# EAGLE schematic phase and amplifier (EAGLE 9.1.2)
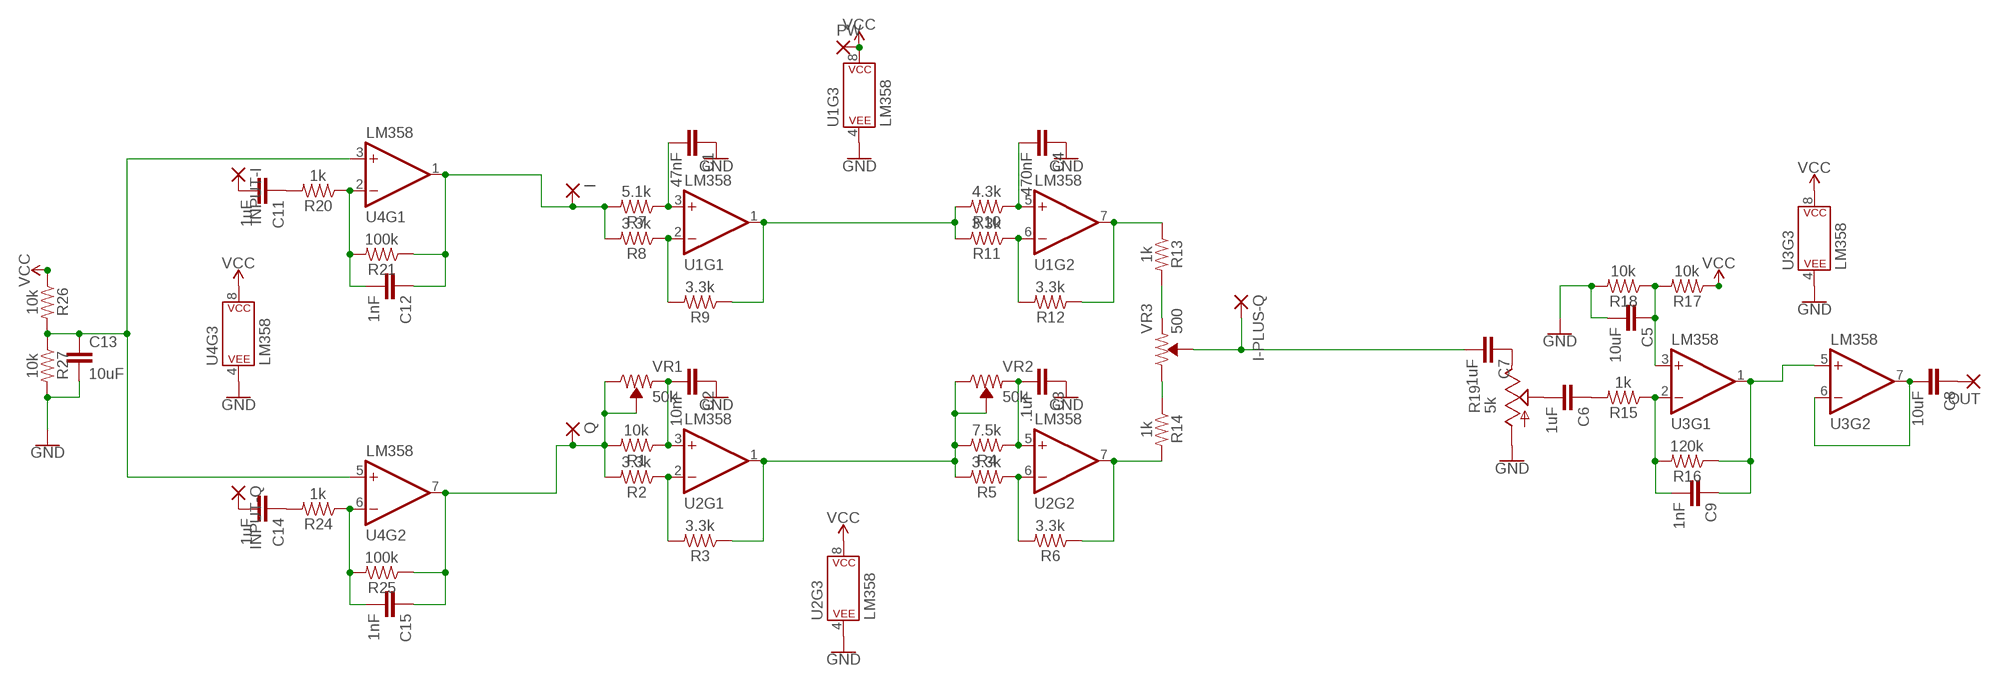
[diagram p0: schematic, sheet 1]

## Parts
C1  47nF  C5/3.5  [C5B3.5]
C2  10nF  C5/3.5  [C5B3.5]
C3  .1uF  C5/3.5  [C5B3.5]
C4  470nF  C5/3.5  [C5B3.5]
C5  10uF  C5/3.5  [C5B3.5]
C6  1uF  C5/3.5  [C5B3.5]
C7  1uF  C5/3.5  [C5B3.5]
C8  10uF  C5/3.5  [C5B3.5]
C9  1nF  C5/3.5  [C5B3.5]
C11  1uF  C5/3.5  [C5B3.5]
C12  1nF  C5/3.5  [C5B3.5]
C13  10uF  C5/3.5  [C5B3.5]
C14  1uF  C5/3.5  [C5B3.5]
C15  1nF  C5/3.5  [C5B3.5]
I  2,54/1,1  [2,54/1,1]
I-PLUS-Q  2,54/1,1  [2,54/1,1]
INPUT-I  2,54/1,1  [2,54/1,1]
INPUT-Q  2,54/1,1  [2,54/1,1]
OUT  2,54/1,1  [2,54/1,1]
PW  2,54/1,1  [2,54/1,1]
Q  2,54/1,1  [2,54/1,1]
R1  10k  1KOHM-HORIZ-1/4W-1%  [AXIAL-0.3]
R2  3.3k  1KOHM-HORIZ-1/4W-1%  [AXIAL-0.3]
R3  3.3k  1KOHM-HORIZ-1/4W-1%  [AXIAL-0.3]
R4  7.5k  1KOHM-HORIZ-1/4W-1%  [AXIAL-0.3]
R5  3.3k  1KOHM-HORIZ-1/4W-1%  [AXIAL-0.3]
R6  3.3k  1KOHM-HORIZ-1/4W-1%  [AXIAL-0.3]
R7  5.1k  1KOHM-HORIZ-1/4W-1%  [AXIAL-0.3]
R8  3.3k  1KOHM-HORIZ-1/4W-1%  [AXIAL-0.3]
R9  3.3k  1KOHM-HORIZ-1/4W-1%  [AXIAL-0.3]
R10  4.3k  1KOHM-HORIZ-1/4W-1%  [AXIAL-0.3]
R11  3.3k  1KOHM-HORIZ-1/4W-1%  [AXIAL-0.3]
R12  3.3k  1KOHM-HORIZ-1/4W-1%  [AXIAL-0.3]
R13  1k  1KOHM-HORIZ-1/4W-1%  [AXIAL-0.3]
R14  1k  1KOHM-HORIZ-1/4W-1%  [AXIAL-0.3]
R15  1k  1KOHM-HORIZ-1/4W-1%  [AXIAL-0.3]
R16  120k  1KOHM-HORIZ-1/4W-1%  [AXIAL-0.3]
R17  10k  1KOHM-HORIZ-1/4W-1%  [AXIAL-0.3]
R18  10k  1KOHM-HORIZ-1/4W-1%  [AXIAL-0.3]
R19  5k  TRIM_US-B25V  [B25V]
R20  1k  1KOHM-HORIZ-1/4W-1%  [AXIAL-0.3]
R21  100k  1KOHM-HORIZ-1/4W-1%  [AXIAL-0.3]
R24  1k  1KOHM-HORIZ-1/4W-1%  [AXIAL-0.3]
R25  100k  1KOHM-HORIZ-1/4W-1%  [AXIAL-0.3]
R26  10k  1KOHM-HORIZ-1/4W-1%  [AXIAL-0.3]
R27  10k  1KOHM-HORIZ-1/4W-1%  [AXIAL-0.3]
U1  LM358  [DIP08]
U2  LM358  [DIP08]
U3  LM358  [DIP08]
U4  LM358  [DIP08]
VR1  50k  TRIMPOT-PTH-10MM-KNOB-1/2W-10%  [TRIMPOT-PTH-3386U]
VR2  50k  TRIMPOT-PTH-10MM-KNOB-1/2W-10%  [TRIMPOT-PTH-3386U]
VR3  500  TRIMPOT-PTH-10MM-KNOB-1/2W-10%  [TRIMPOT-PTH-3386U]

## Nets
GND: C1.1 C2.1 C3.1 C4.1 C5.2 C13.2 R18.P$2 R19.A R27.P$2 U1.4(P$V-) U2.4(P$V-) U3.4(P$V-) U4.4(P$V-)
N$1: C2.2 R1.P$1 U2.3(+IN) VR1.1(CCW)
N$2: R2.P$1 R3.P$2 U2.2(-IN)
N$3: R3.P$1 R4.P$2 R5.P$2 U2.1(OUT) VR2.2(WIPER) VR2.3(CW)
N$4: C13.1 R26.P$2 R27.P$1 U4.3(+IN) U4.5(+IN)
N$5: C3.2 R4.P$1 U2.5(+IN) VR2.1(CCW)
N$6: R5.P$1 R6.P$2 U2.6(-IN)
N$7: R8.P$1 R9.P$2 U1.2(-IN)
N$8: R6.P$1 R14.P$2 U2.7(OUT)
N$9: C1.2 R7.P$1 U1.3(+IN)
N$10: C14.2 INPUT-Q.1(P)
N$11: C4.2 R10.P$1 U1.5(+IN)
N$12: R9.P$1 R10.P$2 R11.P$2 U1.1(OUT)
N$13: R11.P$1 R12.P$2 U1.6(-IN)
N$14: R13.P$2 VR3.1(CCW)
N$15: R12.P$1 R13.P$1 U1.7(OUT)
N$16: R14.P$1 VR3.3(CW)
N$17: C7.2 I-PLUS-Q.1(P) VR3.2(WIPER)
N$18: C9.1 R16.P$1 U3.1(OUT) U3.5(+IN)
N$19: C9.2 R15.P$1 R16.P$2 U3.2(-IN)
N$20: C5.1 R17.P$2 R18.P$1 U3.3(+IN)
N$21: C6.1 R15.P$2
N$22: C6.2 R19.S
N$23: C7.1 R19.E
N$24: C12.1 I.1(P) R7.P$2 R8.P$2 R21.P$1 U4.1(OUT)
N$25: C8.2 U3.6(-IN) U3.7(OUT)
N$26: C8.1 OUT.1(P)
N$27: C12.2 R20.P$1 R21.P$2 U4.2(-IN)
N$28: C11.2 INPUT-I.1(P)
N$29: C11.1 R20.P$2
N$30: C15.1 Q.1(P) R1.P$2 R2.P$2 R25.P$1 U4.7(OUT) VR1.2(WIPER) VR1.3(CW)
N$31: C15.2 R24.P$1 R25.P$2 U4.6(-IN)
N$33: C14.1 R24.P$2
VCC: PW.1(P) R17.P$1 R26.P$1 U1.8(P$V+) U2.8(P$V+) U3.8(P$V+) U4.8(P$V+)

## Library data of the parts
C1-C9 C11-C15 = capacitor-wima:C: CAPACITOR naming: grid - package width
I I-PLUS-Q INPUT-I INPUT-Q OUT PW Q = wirepad:2,54/1,1: THROUGH-HOLE PAD
R1-R12 R16-R18 R21 R25-R27 = SparkFun-Resistors:1KOHM: 1kΩ resistor A resistor is a passive two-terminal electrical component that implements electrical resistance as a circuit element. Resistors act to reduce current flow, and, at the same time, act to lower voltage levels within circuits. - Wikipedia; PROD_ID: RES-12182; VALUE: 1k
R13-R15 R20 R24 = SparkFun-Resistors:1KOHM: 1kΩ resistor A resistor is a passive two-terminal electrical component that implements electrical resistance as a circuit element. Resistors act to reduce current flow, and, at the same time, act to lower voltage levels within circuits. - Wikipedia; PROD_ID: RES-12182
R19 = pot:TRIM_US-: POTENTIOMETER
U1-U4 = SparkFun-IC-Amplifiers:LM358: LM358 Jellybean op-amp Datasheet <http://www.sparkfun.com/datasheets/Components/General/LM358.pdf> SparkFun Products Op-Amp (Thru-Hole) - LM358 <https://www.sparkfun.com/products/9456> (COM-09456); PROD_ID: IC-09172
VR1-VR3 = SparkFun-Resistors:TRIMPOT: Trimming Potentiometer (Trimpot) Three-terminal potentiometers, with an adjustable wiper and two adjustable resistors. A pot can be used to create a configurable voltage divider, or as a variable resistor. "Trimpots" are a subset of potentiometers, usually intended for "set-and-forget" applications. They're often more delicate than standard potentiometers - rated for fewer turns. Variants PTH-KNOB - PTH Trimpot w/ finger-adjustable knob Trimpot 10K with Knob <https://www.sparkfun.com/products/9806> (COM-09806) Datasheet <http://www.sparkfun.com/datasheets/Components/General/TSR-3386.pdf> SMD-3MM-CLOSED-FRAME - SMD 3mm Square Closed-Frame Trimpot Used on e.g. EasyDriver - Stepper Motor Driver <https://www.sparkfun.com/products/12779> Datasheet <http://www.bitechnologies.com/pdfs/22.pdf> (22AR10KTR) SMD-5MM - SMD 5mm Square Closed-Frame Trimpot Used on e.g. IOIO-OTG - V2.2 <https://www.sparkfun.com/products/13613> Datasheet <http://www.vishay.com/docs/51008/ts53.pdf> (TS53YL502MR10) SMD-3MM-1/10W-25% - 3mm Square Open-Frame Trimpot Used on e.g. SparkFun Shapeoko <https://www.sparkfun.com/products/13899> Datasheet <http://www.bourns.com/docs/Product-Datasheets/TC33.pdf> (TC33X-2-103E); PROD_ID: RES-09730; SF_SKU: COM-09806; VALUE: 10k

## Net classes
0 default: width 0.762 mm, drill 0.762 mm, clearance 0.508 mm